# Altium schematic sheet RF.SchDoc
size A; SheetNumber: 3; SheetTotal: 4
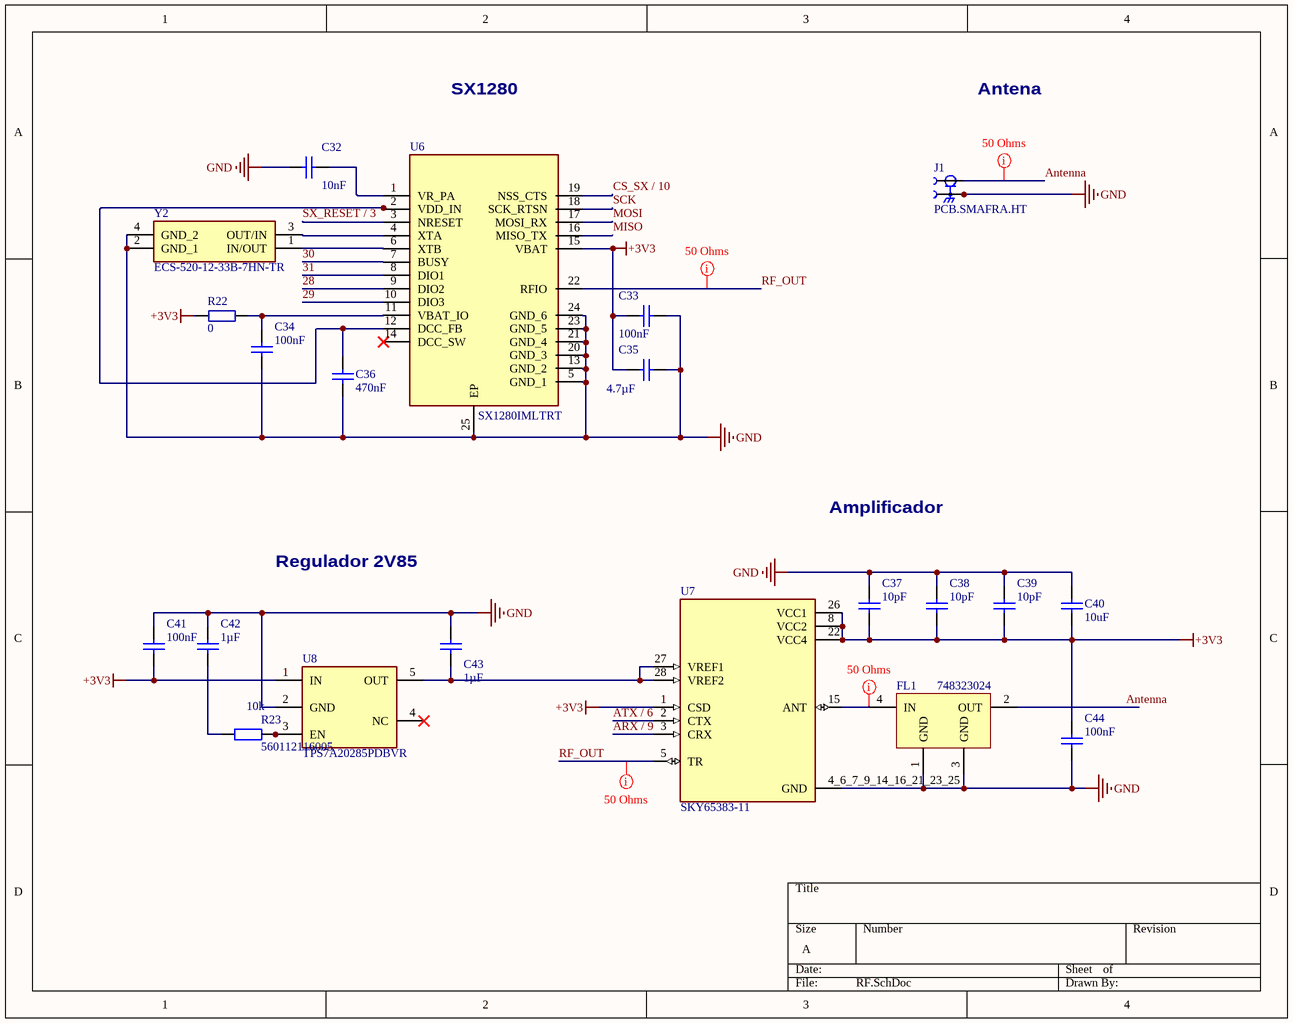
[diagram p0: RF.SchDoc]

## Parts
C32  value 10nF  [WCAP-CSGP_0603_L1.6W0.8H0.8_Reflow]  (hidden comment: 885012206065)
C33  value 100nF  [WCAP-CSGP_0603_L1.6W0.8H0.8_Reflow]  (hidden comment: 885012206071)
C34  value 100nF  [WCAP-CSGP_0603_L1.6W0.8H0.8_Reflow]  (hidden comment: 885012206071)
C35  value 4.7µF  [WCAP-CSGP_0603_L1.6W0.8H0.8_Reflow]  (hidden comment: 885012106012)
C36  value 470nF  [MY_0603]  (hidden comment: Cap ceramic)
C37  value 10pF  [WCAP-CSGP_0603_L1.6W0.8H0.8_Reflow]  (hidden comment: 885012006051)
C38  value 10pF  [WCAP-CSGP_0603_L1.6W0.8H0.8_Reflow]  (hidden comment: 885012006051)
C39  value 10pF  [WCAP-CSGP_0603_L1.6W0.8H0.8_Reflow]  (hidden comment: 885012006051)
C40  value 10uF  [MY_0603]  (hidden comment: Cap ceramic)
C41  value 100nF  [WCAP-CSGP_0603_L1.6W0.8H0.8_Reflow]  (hidden comment: 885012206071)
C42  value 1µF  [WCAP-CSGP_0603_L1.6W0.8H0.8_Reflow]  (hidden comment: 885012206052)
C43  value 1µF  [WCAP-CSGP_0603_L1.6W0.8H0.8_Reflow]  (hidden comment: 885012206052)
C44  value 100nF  [WCAP-CSGP_0603_L1.6W0.8H0.8_Reflow]  (hidden comment: 885012206071)
FL1  748323024  [WE-BPF_0805]
J1  PCB.SMAFRA.HT  [FP-PCB_SMAFRA_HT-MFG]
R22  0  [R0603-0.45]
R23  560112116005  value 10k  [WRIS-RSKS_0603_Reflow]
U6  SX1280IMLTRT  [SX1280IMLTRT-Footprint-1]
U7  SKY65383-11  [SKY65383-11-Footprint-1]
U8  TPS7A20285PDBVR  [TPS7A20285PDBVR-Footprint-1]
Y2  ECS-520-12-33B-7HN-TR  [ECS-520-12-33B-7HN-TR-Footprint-1]

## Nets
+3V3: C33.1 C35.1 C37.2 C38.2 C39.2 C40.2 C41.2 C44.1 R22.1 U6.15(VBAT) U7.1(CSD) U7.8(VCC2) U7.22(VCC4) U7.26(VCC1) U8.1(IN)
GND: C32.2 C33.2 C34.2 C35.2 C36.2 C37.1 C38.1 C39.1 C40.1 C41.1 C42.1 C43.2 C44.2 FL1.1(GND) FL1.3(GND) J1.S1 J1.S2 J1.S3 J1.S4 U6.5(GND_1) U6.13(GND_2) U6.20(GND_3) U6.21(GND_4) U6.23(GND_5) U6.24(GND_6) U6.25(EP) U7.4_6_7_9_14_16_21_23_25(GND) U8.2(GND) Y2.2(GND_1) Y2.4(GND_2)
28: U6.9(DIO2)
29: U6.10(DIO3)
30: U6.7(BUSY)
31: U6.8(DIO1)
Antenna: FL1.2(OUT) J1.1
ARX / 9: U7.3(CRX)
ATX / 6: U7.2(CTX)
CS_SX / 10: U6.19(NSS_CTS)
MISO: U6.16(MISO_TX)
MOSI: U6.17(MOSI_RX)
RF_OUT: U6.22(RFIO) U7.5(TR)
SCK: U6.18(SCK_RTSN)
SX_RESET / 3: U6.3(NRESET)
NetC32_1: C32.1 U6.1(VR_PA)
NetC34_1: C34.1 R22.2 U6.11(VBAT_IO)
NetC36_1: C36.1 U6.2(VDD_IN) U6.12(DCC_FB)
NetC42_2: C42.2 R23.2
NetC43_1: C43.1 U7.27(VREF1) U7.28(VREF2) U8.5(OUT)
NetFL1_4: FL1.4(IN) U7.15(ANT)
NetR23_1: R23.1 U8.3(EN)
NetU6_4: U6.4(XTA) Y2.3(OUT/IN)
NetU6_6: U6.6(XTB) Y2.1(IN/OUT)

Not connected (* = marked no-connect by the designer): U6 14(DCC_SW)*; U8 4(NC)*

## Layout directives
mark named 50 Ohms: Antenna, NetFL1_4, RF_OUT

## Notes on the sheet
- SX1280
- Antena
- Regulador 2V85
- Amplificador

## Library data of the parts
C32 = CMP-001-00655-1: WCAP-CSGP Multilayer Ceramic Chip Capacitor, General Purpose, size 0603, X7R, 10nF, 25VDC; Manufacturer: Wurth Elektronik; Dissipation Factor: 3.5%; Technical Reference: X7R0603103K025DFCT10000; Capacitance Tolerance: +/-10%; Insulation Resistance: 10GOhm; Rated Voltage (DC): 25V; Source: WCAP-CSGP.SchLib; Design Item ID: 885012206065; Component Type: Standard; ComponentLink1Description: Website Link; Packaging: Tape and Reel; Match Code: WCAP-CSGP; Ceramic Type: X7R; ComponentLink1URL: https://www.we-online.com/redexpert/article/885012206065?ad; ComponentLink2URL: https://www.we-online.com/redexpert/spec/885012206065?ad; Case/Package: 0603; Operating Temperature Min: -55°C; ComponentLink2Description: Datasheet Link; Category: Multilayer Ceramic Chip Capacitors; Pins: 2; Mount: Surface Mount; Height: 0.8mm; Length: 1.6mm; Operating Temperature Max: 125°C; Width: 0.8mm; Manufacturer Part Number: 885012206065
C33 C34 C41 C44 = CMP-001-00661-1: WCAP-CSGP Multilayer Ceramic Chip Capacitor, General Purpose, size 0603, X7R, 100nF, 25VDC; Manufacturer: Wurth Elektronik; Dissipation Factor: 3.5%; Capacitance Tolerance: +/-10%; Insulation Resistance: 5GOhm; Technical Reference: X7R0603104K025DFCT10000; Rated Voltage (DC): 25V; Source: WCAP-CSGP.SchLib; Design Item ID: 885012206071; Component Type: Standard; Packaging: Tape and Reel; Height: 0.8mm; Mount: Surface Mount; Category: Multilayer Ceramic Chip Capacitors; Operating Temperature Min: -55°C; Case/Package: 0603; ComponentLink2Description: Datasheet Link; Width: 0.8mm; ComponentLink1URL: https://www.we-online.com/redexpert/article/885012206071?ad; Length: 1.6mm; Operating Temperature Max: 125°C; Match Code: WCAP-CSGP; ComponentLink2URL: https://www.we-online.com/redexpert/spec/885012206071?ad; ComponentLink1Description: Website Link; Manufacturer Part Number: 885012206071; Pins: 2; Ceramic Type: X7R
C35 = CMP-001-00440-1: WCAP-CSGP Multilayer Ceramic Chip Capacitor, General Purpose, size 0603, X5R, 4.7uF, 10VDC; Manufacturer: Wurth Elektronik; Rated Voltage (DC): 10V; Technical Reference: X5R0603475M010DFCT10000; Dissipation Factor: 10%; Insulation Resistance: 0.02GOhm; Capacitance Tolerance: +/-20%; Source: WCAP-CSGP.SchLib; Design Item ID: 885012106012; Component Type: Standard; ComponentLink2URL: https://www.we-online.com/redexpert/spec/885012106012?ad; Height: 0.8mm; Packaging: Tape and Reel; Case/Package: 0603; Manufacturer Part Number: 885012106012; Width: 0.8mm; Match Code: WCAP-CSGP; Mount: Surface Mount; Ceramic Type: X5R; Operating Temperature Max: 85°C; ComponentLink1Description: Website Link; Length: 1.6mm; ComponentLink1URL: https://www.we-online.com/redexpert/article/885012106012?ad; ComponentLink2Description: Datasheet Link; Category: Multilayer Ceramic Chip Capacitors; Operating Temperature Min: -55°C; Pins: 2
C36 C40 = CMP-015-000000-1: None polar capacitor; ASiD Part Number: C-AS; Source: PCB_Project1.SCHLIB; Pin Count: 2; Design Item ID: Cap ceramic; Component Type: Standard
C37-C39 = CMP-001-00167-1: WCAP-CSGP Multilayer Ceramic Chip Capacitor, General Purpose, size 0603, NP0, 10pF, 50VDC; Manufacturer: Wurth Elektronik; Technical Reference: NP00603100J050DFCT10000; Q Factor: 600; Capacitance Tolerance: +/-5%; Rated Voltage (DC): 50V; Insulation Resistance: 10GOhm; Source: WCAP-CSGP.SchLib; Design Item ID: 885012006051; Component Type: Standard; Match Code: WCAP-CSGP; Operating Temperature Min: -55°C; ComponentLink2Description: Datasheet Link; Packaging: Tape and Reel; Category: Multilayer Ceramic Chip Capacitors; ComponentLink2URL: https://www.we-online.com/redexpert/spec/885012006051?ad; Operating Temperature Max: 125°C; Mount: Surface Mount; ComponentLink1URL: https://www.we-online.com/redexpert/article/885012006051?ad; ComponentLink1Description: Website Link; Ceramic Type: NP0; Case/Package: 0603; Height: 0.8mm; Width: 0.8mm; Length: 1.6mm; Manufacturer Part Number: 885012006051; Pins: 2
C42 C43 = CMP-001-00642-1: WCAP-CSGP Multilayer Ceramic Chip Capacitor, General Purpose, size 0603, X7R, 1uF, 16VDC; Manufacturer: Wurth Elektronik; Capacitance Tolerance: +/-10%; Insulation Resistance: 0.1GOhm; Rated Voltage (DC): 16V; Dissipation Factor: 10%; Technical Reference: X7R0603105K016DFCT10000; Source: WCAP-CSGP.SchLib; Design Item ID: 885012206052; Component Type: Standard; Width: 0.8mm; Ceramic Type: X7R; ComponentLink1Description: Website Link; ComponentLink1URL: https://www.we-online.com/redexpert/article/885012206052?ad; Height: 0.8mm; Manufacturer Part Number: 885012206052; Match Code: WCAP-CSGP; Case/Package: 0603; Operating Temperature Min: -55°C; ComponentLink2Description: Datasheet Link; ComponentLink2URL: https://www.we-online.com/redexpert/spec/885012206052?ad; Category: Multilayer Ceramic Chip Capacitors; Packaging: Tape and Reel; Pins: 2; Length: 1.6mm; Operating Temperature Max: 125°C; Mount: Surface Mount
FL1 = CMP-00025-00001-1: Band Pass Filter; RoHS Compliant: Yes
J1 = CMP-002-00007-2: CONNSMAJACKR/A50OHMPCB
R22 = CMP-009-000000-6: Resistor, generic; Pin Count: 2; Design Item ID: R; Source: Resistors.SchLib; Component Type: Standard
R23 = CMP-009-00328-1: WRIS-RSKS Thick Film Resistor, size 0603, 10000Ohm, 100mW; Manufacturer: Wurth Elektronik; Limiting Element Voltage: 75V; Temperature Coefficient of Resistance Max: 100ppm/°C; Resistance Tolerance: +/-1%; Temperature Coefficient of Resistance Min: -100ppm/°C; Pins: 2; Design Item ID: 560112116005; Source: WRIS-RSKS.SchLib; Case/Package: 0603; Component Type: Standard; ComponentLink1Description: Website Link; Match Code: WRIS-RSKS; Operating Temperature Max: 155°C; Width: 0.8mm; Length: 1.6mm; ComponentLink2Description: Datasheet Link; ComponentLink2URL: https://www.we-online.com/redexpert/spec/560112116005?ad; Packaging: Tape and Reel; Height: 0.45mm; Manufacturer Part Number: 560112116005; Mount: Surface Mount; Operating Temperature Min: -55°C; Rated Power: 100mW; ComponentLink1URL: https://www.we-online.com/redexpert/article/560112116005?ad; Category: Thick Film Resistors
U6 = CMP-00025-00000-6: Telecom Circuit; RoHS Compliant: Yes
U7 = CMP-014-00003-3: RF and Baseband Circuit; Nominal Supply Voltage: 3.3V; Channels: 1; Max Operating Temperature: 85°C; Min Operating Temperature: -40°C; Pins: 28; Case/Package: QCCN; RoHS Compliant: Yes
U8 = CMP-012-00003-1: 300-mA, ultra-low-noise, low-IQ, low-dropout (LDO) linear regulator with high PSRR 5-SOT-23 -40 to 125
Y2 = CMP-003-00000-1: Crystals 52.000 MHz 12 pF ECS-33B +/-7/15 ppm -40 - +85C +/-1 ppm Aging 3225 4-SMD RoHS